# Altium schematic sheet LAN9252-2.SchDoc
size B
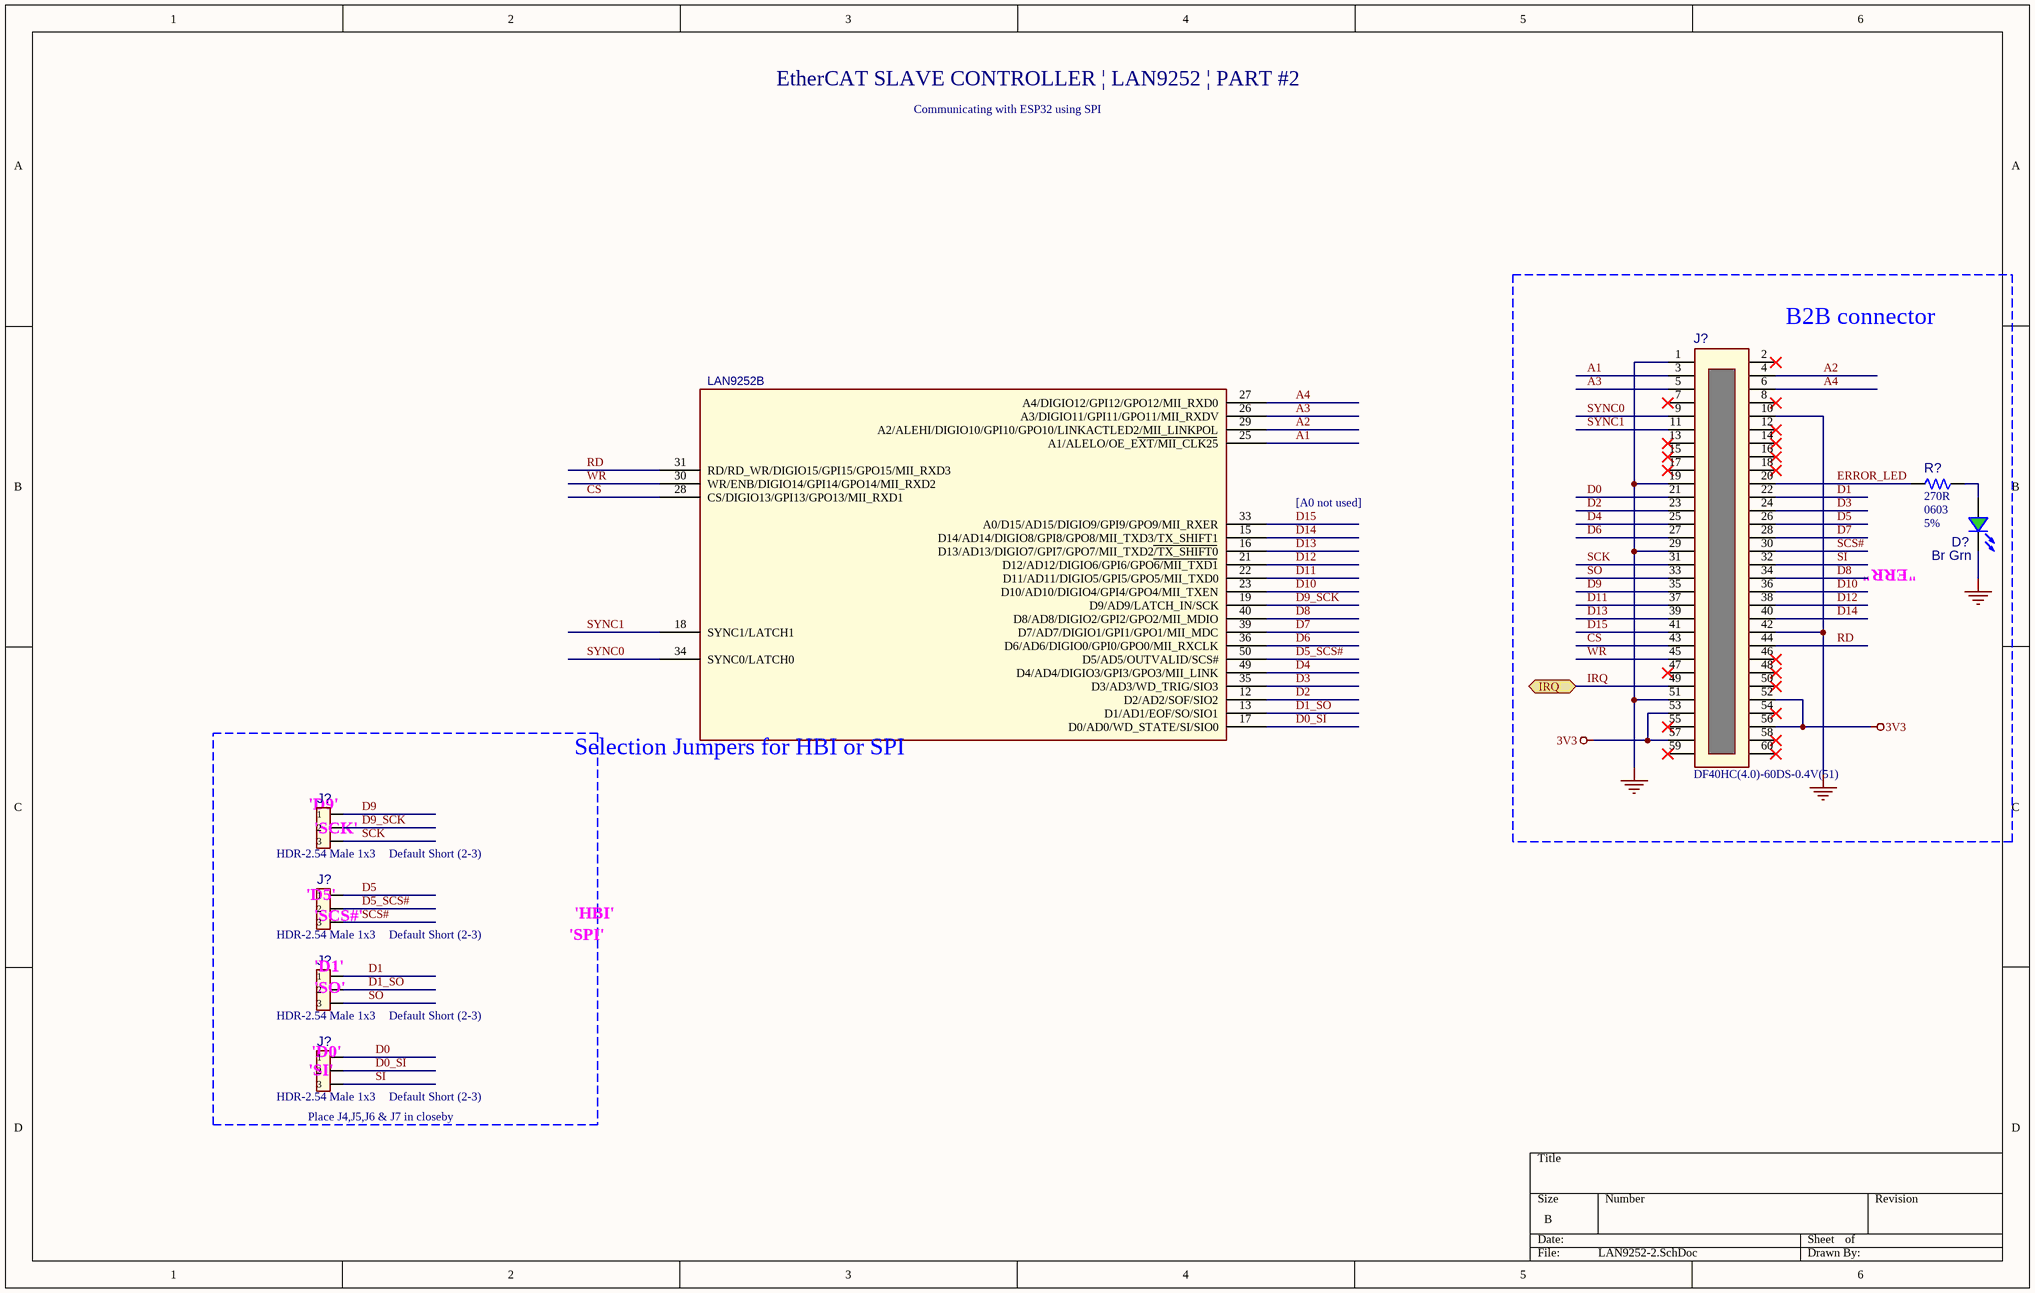
[diagram p0: LAN9252-2.SchDoc]

## Parts
(Parts that share a designator on the sheet are numbered #1, #2 ... from top to bottom, then left to right.)
D?  value Br Grn  [LED_0603_GREEN]  (hidden comment: LED, Bright Green, 0603)
J?#1  value DF40HC(4.0)-60DS-0.4V(51)  [CONN_DF40HC(4.0)-60DS-0.4V(51)]  (hidden comment: CONN DF40)
J?#2  value HDR-2.54 Male 1x3  [HDR_M_2.54_1x3]  (hidden comment: Header 1x3)
J?#3  value HDR-2.54 Male 1x3  [HDR_M_2.54_1x3]  (hidden comment: Header 1x3)
J?#4  value HDR-2.54 Male 1x3  [HDR_M_2.54_1x3]  (hidden comment: Header 1x3)
J?#5  value HDR-2.54 Male 1x3  [HDR_M_2.54_1x3]  (hidden comment: Header 1x3)
LAN9252  (no value)  [QFN-64_9x9_EP6SQ]  (part B of 2)
R?  value 270R  Package: 0603  Tolerance: 5%  [RES_C_0603]  (hidden comment: Resistor)

## Blocks framed on the sheet
B2B connector: D? J?#1 R?
Selection Jumpers for HBI or SPI: J?#2-J?#5

## Ports
IRQ (bidir)

## Nets
3V3: J?#1.52(P52) J?#1.53(P53) J?#1.56(P56) J?#1.57(P57)
GND: D?.2(K) J?#1.1(P1) J?#1.10(P10) J?#1.19(P19) J?#1.29(P29) J?#1.42(P42) J?#1.51(P51)
A1: J?#1.3(P3) LAN9252.25(A1/ALELO/OE_EXT/MII_CLK25)
A2: J?#1.4(P4) LAN9252.29(A2/ALEHI/DIGIO10/GPI10/GPO10/LINKACTLED2/MII_LINKPOL)
A3: J?#1.5(P5) LAN9252.26(A3/DIGIO11/GPI11/GPO11/MII_RXDV)
A4: J?#1.6(P6) LAN9252.27(A4/DIGIO12/GPI12/GPO12/MII_RXD0)
CS: J?#1.43(P43) LAN9252.28(CS/DIGIO13/GPI13/GPO13/MII_RXD1)
D0: J?#1.21(P21) J?#5.1
D0_SI: J?#5.2 LAN9252.17(D0/AD0/WD_STATE/SI/SIO0)
D1: J?#1.22(P22) J?#4.1
D1_SO: J?#4.2 LAN9252.13(D1/AD1/EOF/SO/SIO1)
D2: J?#1.23(P23) LAN9252.12(D2/AD2/SOF/SIO2)
D3: J?#1.24(P24) LAN9252.35(D3/AD3/WD_TRIG/SIO3)
D4: J?#1.25(P25) LAN9252.49(D4/AD4/DIGIO3/GPI3/GPO3/MII_LINK)
D5: J?#1.26(P26) J?#3.1
D5_SCS#: J?#3.2 LAN9252.50(D5/AD5/OUTVALID/SCS#)
D6: J?#1.27(P27) LAN9252.36(D6/AD6/DIGIO0/GPI0/GPO0/MII_RXCLK)
D7: J?#1.28(P28) LAN9252.39(D7/AD7/DIGIO1/GPI1/GPO1/MII_MDC)
D8: J?#1.34(P34) LAN9252.40(D8/AD8/DIGIO2/GPI2/GPO2/MII_MDIO)
D9: J?#1.35(P35) J?#2.1
D9_SCK: J?#2.2 LAN9252.19(D9/AD9/LATCH_IN/SCK)
D10: J?#1.36(P36) LAN9252.23(D10/AD10/DIGIO4/GPI4/GPO4/MII_TXEN)
D11: J?#1.37(P37) LAN9252.22(D11/AD11/DIGIO5/GPI5/GPO5/MII_TXD0)
D12: J?#1.38(P38) LAN9252.21(D12/AD12/DIGIO6/GPI6/GPO6/MII_TXD1)
D13: J?#1.39(P39) LAN9252.16(D13/AD13/DIGIO7/GPI7/GPO7/MII_TXD2/TX_SHIFT0)
D14: J?#1.40(P40) LAN9252.15(D14/AD14/DIGIO8/GPI8/GPO8/MII_TXD3/TX_SHIFT1)
D15: J?#1.41(P41) LAN9252.33(A0/D15/AD15/DIGIO9/GPI9/GPO9/MII_RXER)
ERROR_LED: J?#1.20(P20) R?.2
IRQ: J?#1.49(P49) ; port IRQ
RD: J?#1.44(P44) LAN9252.31(RD/RD_WR/DIGIO15/GPI15/GPO15/MII_RXD3)
SCK: J?#1.31(P31) J?#2.3
SCS#: J?#1.30(P30) J?#3.3
SI: J?#1.32(P32) J?#5.3
SO: J?#1.33(P33) J?#4.3
SYNC0: J?#1.9(P9) LAN9252.34(SYNC0/LATCH0)
SYNC1: J?#1.11(P11) LAN9252.18(SYNC1/LATCH1)
WR: J?#1.45(P45) LAN9252.30(WR/ENB/DIGIO14/GPI14/GPO14/MII_RXD2)
NetD?_1: D?.1(A) R?.1

Not connected (* = marked no-connect by the designer): J?#1 2(P2)* 7(P7)* 8(P8)* 12(P12)* 13(P13)* 14(P14)* 15(P15)* 16(P16)* 17(P17)* 18(P18)* 46(P46)* 47(P47)* 48(P48)* 50(P50)* 54(P54)* 55(P55)* 58(P58)* 59(P59)* 60(P60)*

## Notes on the sheet
- EtherCAT SLAVE CONTROLLER | LAN9252 | PART #2
- Communicating with ESP32 using SPI
- [A0 not used]
- (near D?) "ERR"
- (near J?#2) 'D9'
- (near J?#2) 'SCK'
- (near J?#3) 'D5'
- Default Short (2-3)
- (near J?#3) 'SCS#'
- (near J?#4) 'D1'
- 'SPI'
- 'HBI'
- (near J?#4) 'SO'
- (near J?#5) 'SI'
- (near J?#5) 'D0'
- (near J?#5) Place J4,J5,J6 & J7 in closeby

## Library data of the parts
D? = LED, Bright Green, 0603: Manufacturer 1: Lite-On; Manufacturer Part Number 1: LTST-C191KGKT; Type: LED Single; Forward Current: 20mA; MCD: 35mcd; Owner: Jennifer Hancock; Viewing Angle: 130°; Revision: -; Description_: LED, Bright Green, 0603; Package: 0603 (1608 Metric); ComponentLink1URL: http://optoelectronics.liteon.com/upload/download/DS22-2000-228/S_110_LTST-C191KGKT.pdf; ComponentLink1Description: Datasheet; Category: Diode; Mounting Type: Surface Mount; Supplier 1: Digi-Key; Supplier Part Number 1: 160-1446-6-ND
J?#1 = CONN RCPT 60P 4MM DF40 HRS: Manufacturer 1: Hirose Electric Co Ltd; Owner: Manikandan; Populated: YES; Description_: CONN RCPT 60P 4MM DF40 HRS; ComponentLink1URL: http://nyusperforce.smsc.com//depot_np_hweng_boards/altium_libraries/datasheets/Hirose\DF40HC(4.0)-60DS-0.4V(51).pdf; ComponentLink1Description: Datasheet; Package: 60pin 2 Row; Type: Connector; Category: Interconnects; Manufacturer Part Number 1: DF40HC(4.0)-60DS-0.4V(51); Supplier 1: Digi-Key; Supplier Part Number 1: H11918CT-ND
J?#2-J?#5 = CON0465: Manufacturer 1: Samtec; Manufacturer Part Number 1: TSW-103-07-T-S; Description_: CON HDR-2.54 Male 1x3 Tin 5.84MH TH VERT; Populated: Yes; MCHP-ID: CON0465; Revision: 1; Status: Production; ComponentLink1URL: https://chn-vm-apps.microchip.com/mchprepo/parts/Datasheets/TSW-XXX-XX-XXX-X-XX-XXX-MKT.pdf; ComponentLink1Description: Datasheet; Type: Header 2.54mm; Category: Connector; Supplier 1: Digi-Key; Supplier Part Number 1: SAM1035-03-ND; Quantity Override: 1
LAN9252 = LAN9252_QFN64: IC, 2/3-Port EtherCAT® Slave Controller, QFN64; Manufacturer Part Number 1: LAN9252x/ML; Manufacturer 1: Microchip; Populated: Yes; Owner: Manikandan; Supplier Part Number 1: LAN9252I/ML-ND; Supplier 1: Digikey; Description_: IC, 2/3-Port EtherCAT® Slave Controller, QFN64; RoHS: Yes; Package: QFN64-9X9x1; Document Link: http://ww1.microchip.com/downloads/en/DeviceDoc/00001909A.pdf; Status: New
R? = RES1150: Manufacturer 1: Panasonic; Manufacturer Part Number 1: ERJ-3GEYJ271V; Description_: RES TKF 270R 5% 1/10W SMD 0603; Dev Tools Status: Production; Voltage: 75V; Temperature Coeffcient: 200ppm/C; Power: 1/10W; Owner: Bogdan P (M91398); Populated: Yes; MCHP-ID: RES1150; Revision: 0; Status: MCL Design; ComponentLink1URL: https://chn-vm-apps.microchip.com/mchprepo/parts/Datasheets/AOA0000CE1.pdf; ComponentLink1Description: Datasheet; Operating Temperature: -55C to +155C; Category: Resistor; Type: RES SMD; Composition: TKF; Supplier 1: Digi-Key; Supplier Part Number 1: P270GCT-ND; Quantity Override: 1